# EAGLE design module (EAGLE 9.4.0)
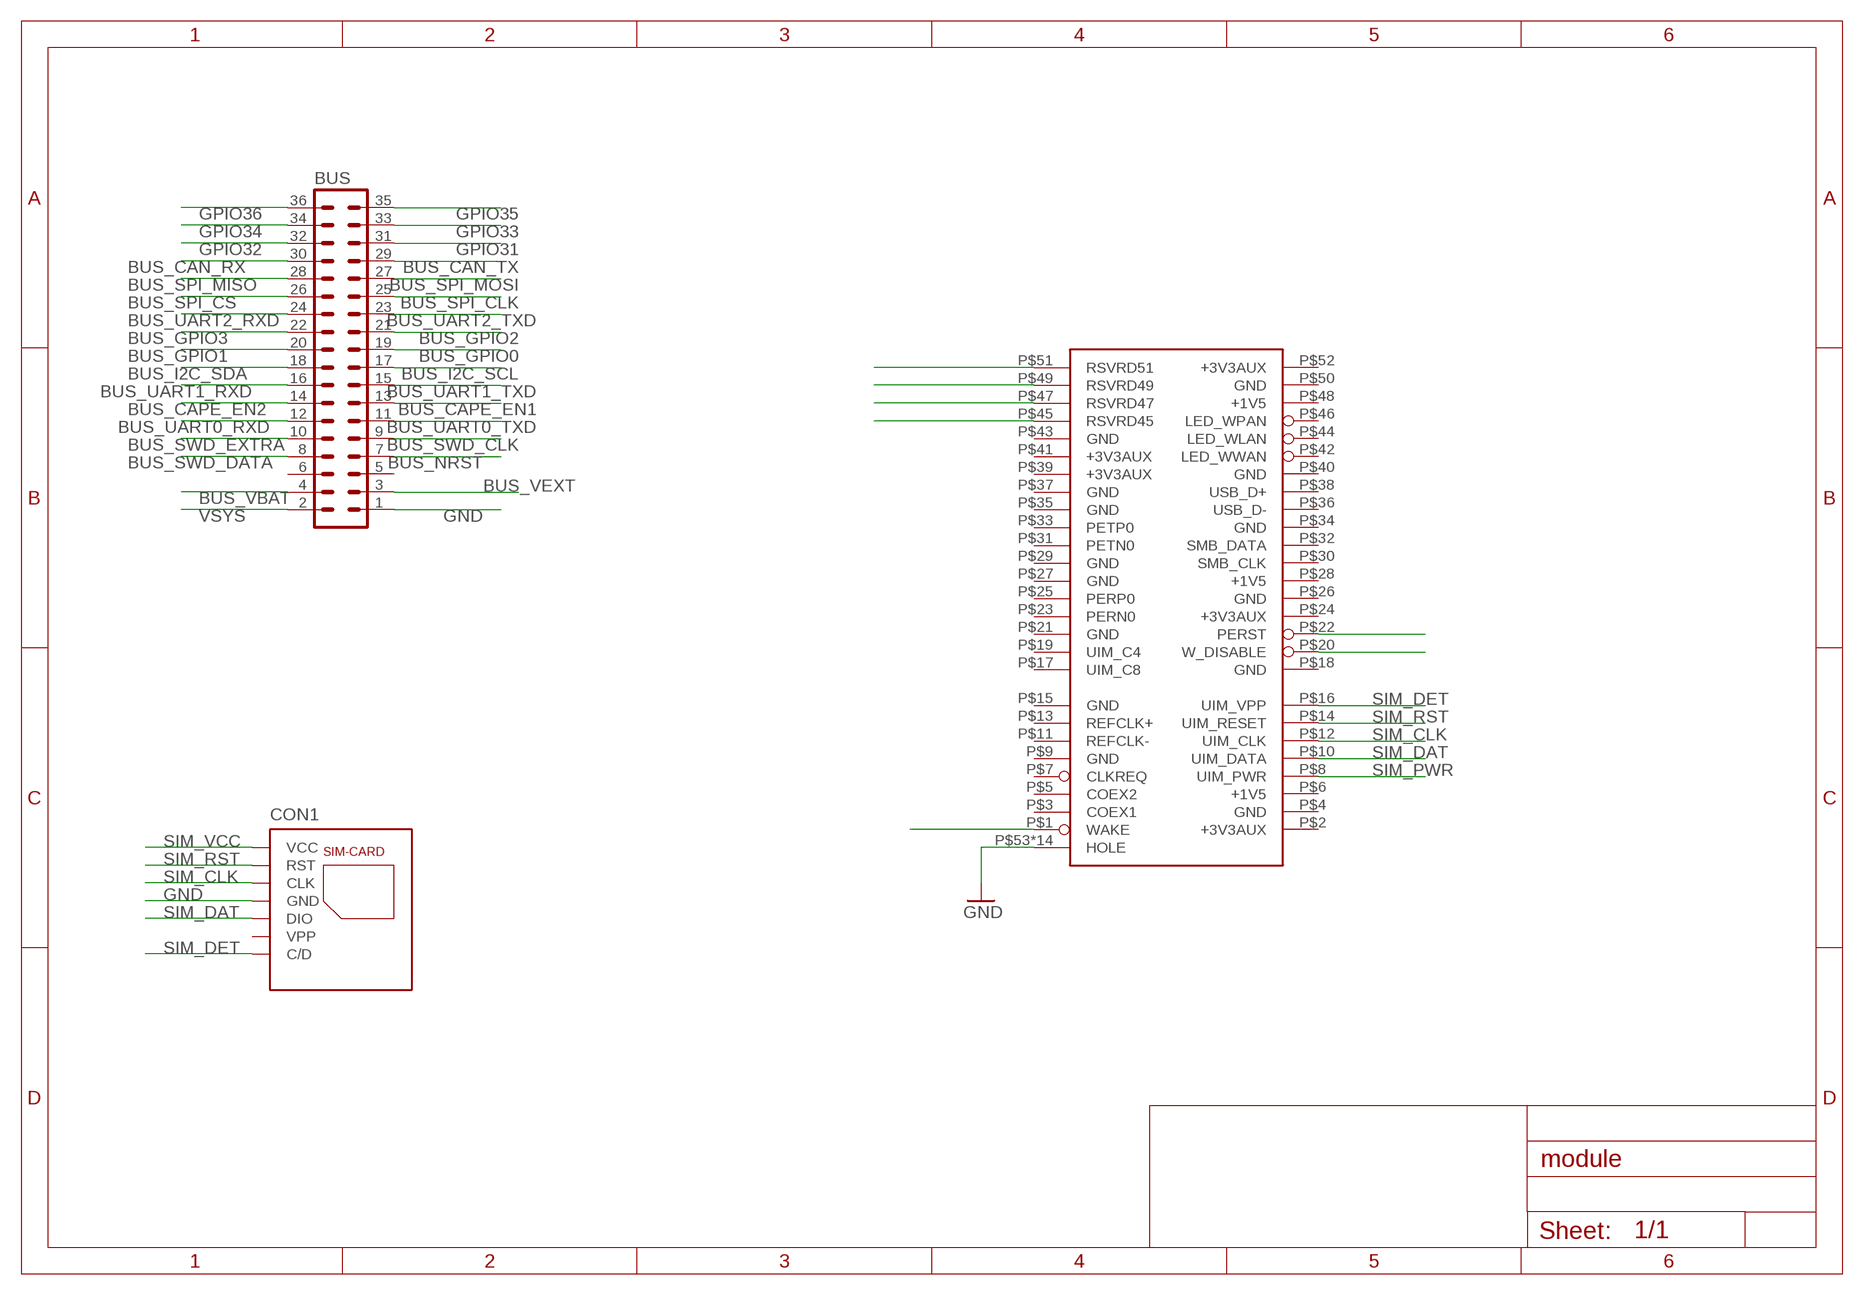
[diagram p0: schematic, sheet 1]

## Parts
BUS  MA18-2  [MA18-2]
CON1  115Q-BCA0  [115Q]
PCI1  119A-XXA00  [119A]

## Nets
BUS_CAN_RX: BUS.30
BUS_CAN_TX: BUS.29
BUS_CAPE_EN1: BUS.13
BUS_CAPE_EN2: BUS.14
BUS_GPIO0: BUS.19
BUS_GPIO1: BUS.20
BUS_GPIO2: BUS.21
BUS_GPIO3: BUS.22
BUS_I2C_SCL: BUS.17
BUS_I2C_SDA: BUS.18
BUS_NRST: BUS.7
BUS_SPI_CLK: BUS.25
BUS_SPI_CS: BUS.26
BUS_SPI_MISO: BUS.28
BUS_SPI_MOSI: BUS.27
BUS_SWD_CLK: BUS.9
BUS_SWD_DATA: BUS.8
BUS_SWD_EXTRA: BUS.10
BUS_UART0_RXD: BUS.12
BUS_UART0_TXD: BUS.11
BUS_UART1_RXD: BUS.16
BUS_UART1_TXD: BUS.15
BUS_UART2_RXD: BUS.24
BUS_UART2_TXD: BUS.23
BUS_VBAT: BUS.4
BUS_VEXT: BUS.3
GND: BUS.1 CON1.GND1(GND) CON1.GND2(GND) CON1.GND3(GND) CON1.GND4(GND) CON1.P5(GND) PCI1.P$53(HOLE) PCI1.P$54(HOLE) PCI1.P$55(HOLE) PCI1.P$56(HOLE) PCI1.P$57(HOLE) PCI1.P$58(HOLE) PCI1.P$59(HOLE) PCI1.P$60(HOLE) PCI1.P$61(HOLE) PCI1.P$62(HOLE) PCI1.P$63(HOLE) PCI1.P$64(HOLE) PCI1.P$65(HOLE) PCI1.P$66(HOLE)
GPIO31: BUS.31
GPIO32: BUS.32
GPIO33: BUS.33
GPIO34: BUS.34
GPIO35: BUS.35
GPIO36: BUS.36
N$1: PCI1.P$51(RSVRD51)
N$2: PCI1.P$49(RSVRD49)
N$3: PCI1.P$47(RSVRD47)
N$4: PCI1.P$45(RSVRD45)
N$5: PCI1.P$20(W_DISABLE)
N$6: PCI1.P$1(WAKE)
N$7: PCI1.P$22(PERST)
SIM_CLK: CON1.P3(CLK) PCI1.P$12(UIM_CLK)
SIM_DAT: CON1.P7(DIO) PCI1.P$10(UIM_DATA)
SIM_DET: CON1.CD(C/D) PCI1.P$16(UIM_VPP)
SIM_PWR: PCI1.P$8(UIM_PWR)
SIM_RST: CON1.P2(RST) PCI1.P$14(UIM_RESET)
SIM_VCC: CON1.P1(VCC)
VSYS: BUS.2
Unconnected: BUS.5 BUS.6 CON1.P6(VPP) PCI1.P$3(COEX1) PCI1.P$5(COEX2) PCI1.P$7(CLKREQ) PCI1.P$11(REFCLK-) PCI1.P$13(REFCLK+) PCI1.P$17(UIM_C8) PCI1.P$19(UIM_C4) PCI1.P$23(PERN0) PCI1.P$25(PERP0) PCI1.P$30(SMB_CLK) PCI1.P$31(PETN0) PCI1.P$33(PETP0) PCI1.P$34(GND) PCI1.P$36(USB_D-) PCI1.P$37(GND) PCI1.P$39(+3V3AUX) PCI1.P$40(GND) PCI1.P$41(+3V3AUX) PCI1.P$42(LED_WWAN) PCI1.P$43(GND) PCI1.P$44(LED_WLAN) PCI1.P$46(LED_WPAN) PCI1.P$48(+1V5) PCI1.P$50(GND)

## Power pins joined to a net without a drawn wire
+1V5: PCI1.P$6(+1V5) PCI1.P$28(+1V5)
+3V3AUX: PCI1.P$2(+3V3AUX) PCI1.P$24(+3V3AUX) PCI1.P$52(+3V3AUX)
GND: PCI1.P$4(GND) PCI1.P$9(GND) PCI1.P$15(GND) PCI1.P$18(GND) PCI1.P$21(GND) PCI1.P$26(GND) PCI1.P$27(GND) PCI1.P$29(GND) PCI1.P$35(GND)
SMB_DATA: PCI1.P$32(SMB_DATA)
USB_D+: PCI1.P$38(USB_D+)

## Library data of the parts
BUS = con-lstb:MA18-2: PIN HEADER; OC_FARNELL: unknown; OC_NEWARK: unknown
CON1 = parts-attend:115Q-BCA0
PCI1 = parts-attend:119A-XXA00

## Board
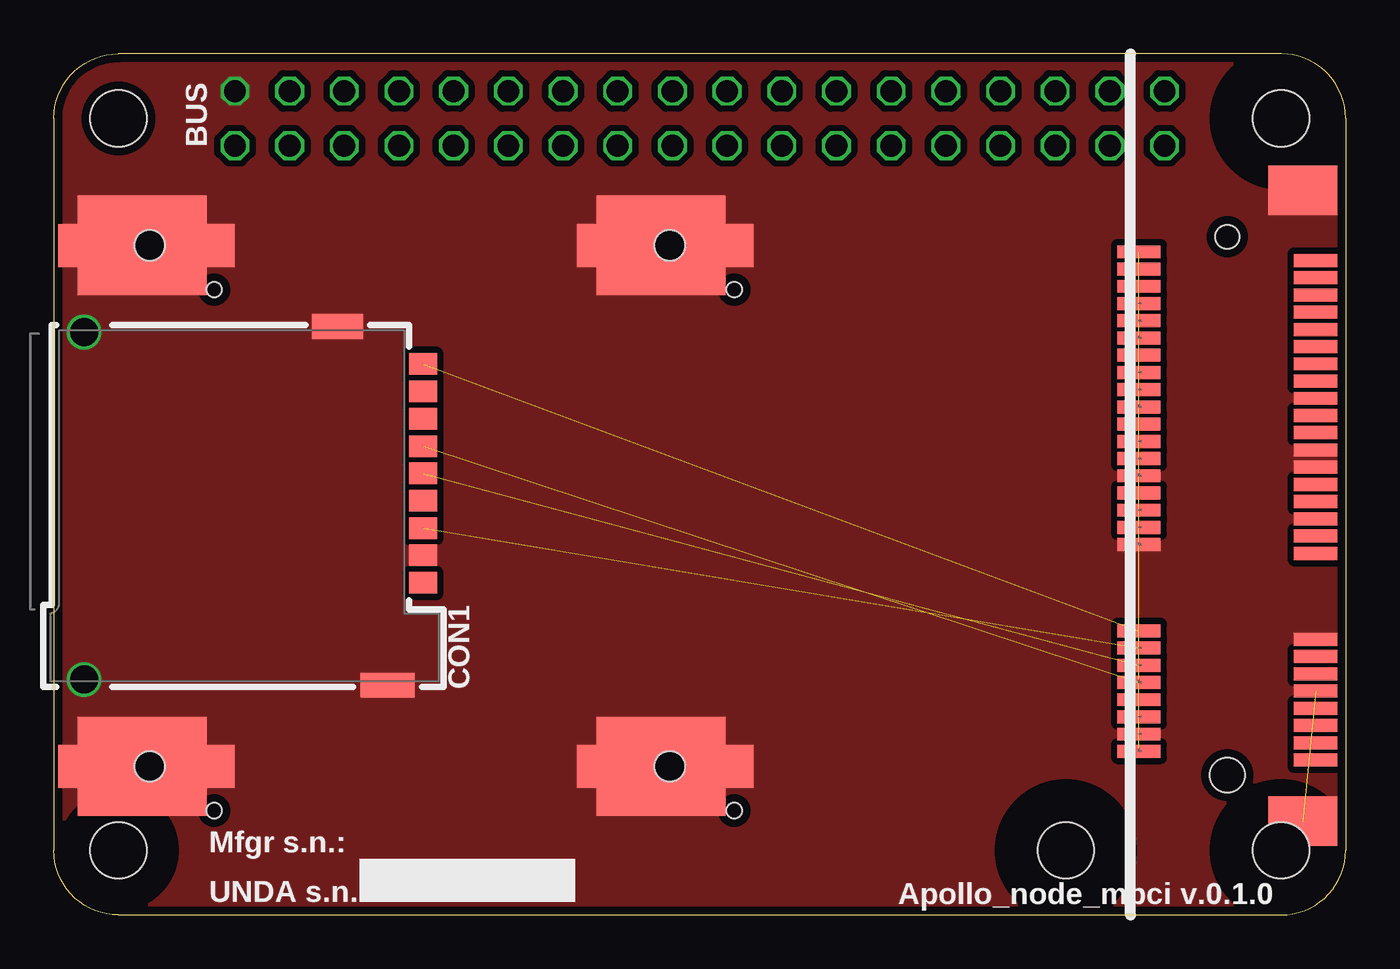
[diagram p1: board, top side]
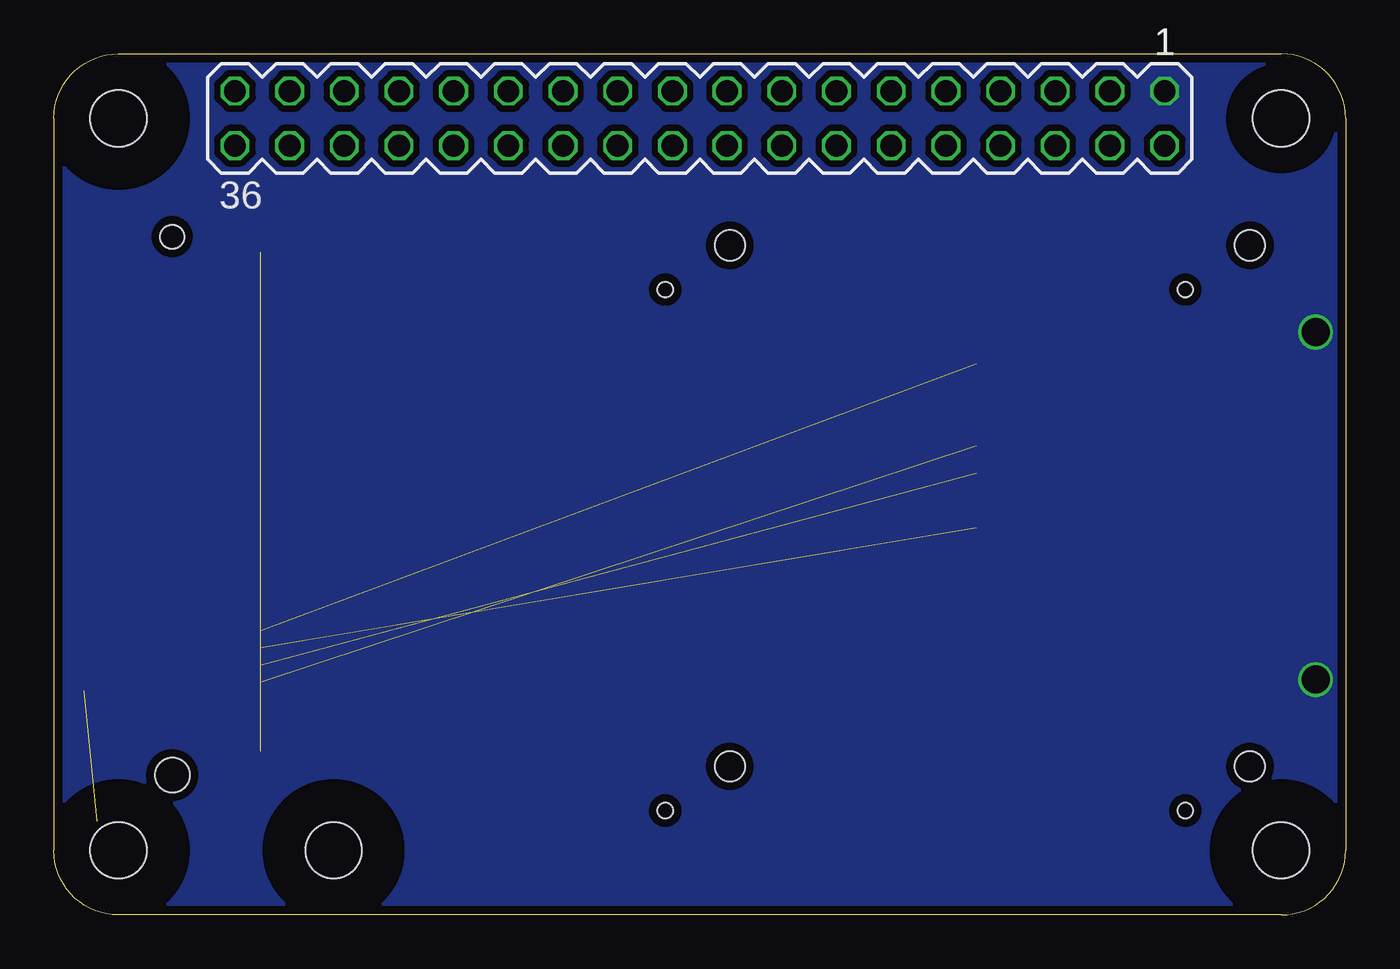
[diagram p2: board, bottom side, seen from below]

Size 60 x 40 mm. Coordinates in mm from the lower left corner, seen from the top.
Outline: 3,0 57,0 arc90 60,3 60,37 arc90 57,40 3,40 arc90 0,37 0,3 arc90 3,0
Copper layers (1*16): Top 0.035mm / dielectric 1mm / Bottom 0.035mm
Design rules "default *": minimum track width 0.2mm, minimum drill 0.3mm, track to track 0.16mm, track to pad 0.16mm, pad to pad 0.16mm, via to via 0.16mm, smd to smd 6mil, copper to edge 0.4mm, drill to drill 0.2mm, minimum pad ring 0.16mm, minimum via ring 0.2mm, stop-mask expansion 0.1mm, vias tented up to drill 0.6mm, thermal gap 10mil
Holes 2.6 mm at 57,3 3,37 3,3 57,37 47,3
tRestrict: area 54,0 to 60,6; area 0.5,0.5 to 5.5,5.5; area 54,34 to 60,40; area 44,0 to 50,6
bRestrict: area 54,0 to 60,6; area 0.8,34.8 to 5.2,39.2; area 0,0 to 6,6; area 54,34 to 60,40; area 44,0 to 50,6

### Footprints (pad centres in the part's own frame; a part is rotated, then mirrored left to right if it is on the bottom)
MA18-2 = drill 1.016 octagon: 1 -21.59,-1.27; 2 -21.59,1.27; 3 -19.05,-1.27; 4 -19.05,1.27; 5 -16.51,-1.27; 6 -16.51,1.27; 7 -13.97,-1.27; 8 -13.97,1.27; 9 -11.43,-1.27; 10 -11.43,1.27; 11 -8.89,-1.27; 12 -8.89,1.27; 13 -6.35,-1.27; 14 -6.35,1.27; 15 -3.81,-1.27; 16 -3.81,1.27; 17 -1.27,-1.27; 18 -1.27,1.27; 19 1.27,-1.27; 20 1.27,1.27; 21 3.81,-1.27; 22 3.81,1.27; 23 6.35,-1.27; 24 6.35,1.27; 25 8.89,-1.27; 26 8.89,1.27; 27 11.43,-1.27; 28 11.43,1.27; 29 13.97,-1.27; 30 13.97,1.27; 31 16.51,-1.27; 32 16.51,1.27; 33 19.05,-1.27; 34 19.05,1.27; 35 21.59,-1.27; 36 21.59,1.27
115Q = smd 1 x 1.3: CD -6.59,0.65; P1 3.57,0.65; P2 1.03,0.65; P3 -1.51,0.65; P4 -4.05,0.65; P5 2.3,0.65; P6 -0.24,0.65; P7 -2.78,0.65; P8 -5.32,0.65 | smd 1.15 x 2.35: GND1 -8.325,-3.32 | smd 1.15 x 2.5: GND2 8.325,-1 | drill 1.3: GND3 -8.07,-15.1; GND4 8.07,-15.1
119A = smd 2 x 0.6: P$1 -4.1,-0.7; P$2 4.1,-1.1; P$3 -4.1,-1.5; P$4 4.1,-1.9; P$5 -4.1,-2.3; P$6 4.1,-2.7; P$7 -4.1,-3.1; P$8 4.1,-3.5; P$9 -4.1,-3.9; P$10 4.1,-4.3; P$11 -4.1,-4.7; P$12 4.1,-5.1; P$13 -4.1,-5.5; P$14 4.1,-5.9; P$15 -4.1,-6.3; P$16 4.1,-6.7; P$17 -4.1,-10.3; P$18 4.1,-10.7; P$19 -4.1,-11.1; P$20 4.1,-11.5; P$21 -4.1,-11.9; P$22 4.1,-12.3; P$23 -4.1,-12.7; P$24 4.1,-13.1; P$25 -4.1,-13.5; P$26 4.1,-13.9; P$27 -4.1,-14.3; P$28 4.1,-14.7; P$29 -4.1,-15.1; P$30 4.1,-15.5; P$31 -4.1,-15.9; P$32 4.1,-16.3; P$33 -4.1,-16.7; P$34 4.1,-17.1; P$35 -4.1,-17.5; P$36 4.1,-17.9; P$37 -4.1,-18.3; P$38 4.1,-18.7; P$39 -4.1,-19.1; P$40 4.1,-19.5; P$41 -4.1,-19.9; P$42 4.1,-20.3; P$43 -4.1,-20.7; P$44 4.1,-21.1; P$45 -4.1,-21.5; P$46 4.1,-21.9; P$47 -4.1,-22.3; P$48 4.1,-22.7; P$49 -4.1,-23.1; P$50 4.1,-23.5; P$51 -4.1,-23.9; P$52 4.1,-24.3 | smd 3.2 x 2.3: P$53 -3.5,2.15; P$54 -3.5,-27.15 | smd 6 x 4.6: P$55 50.4,-0.4; P$58 26.3,-0.4; P$61 50.4,-24.6; P$64 26.3,-24.6 | smd 1.3 x 2: P$56 46.75,-0.4; P$59 22.65,-0.4; P$62 46.75,-24.6; P$65 22.65,-24.6 | smd 0.9 x 2: P$57 53.85,-0.4; P$60 29.75,-0.4; P$63 53.85,-24.6; P$66 29.75,-24.6 | hole 1.6: 0,0 | hole 1.1: 0,-25 | hole 1.4: 25.9,-0.4; 25.9,-24.6; 50.05,-0.4; 50.05,-24.6 | hole 0.7: 47.05,1.65; 22.9,1.65; 47.05,-22.55; 22.9,-22.55

### Placement (x,y rotation side)
BUS  30,37 180 bottom
CON1  16.5,19 270 top
PCI1  54.5,6.5 180 top

### Tracks (layer width: path | path; a pad name or v marks a point on that pad's centre or on a via)
+1V5  (1 unrouted)
+3V3AUX  (2 unrouted)
GND  (1 unrouted)
  pour Bottom (isolate 0.3, rank 6, no thermals): -2,-2 -2,42 62,42 62,-2
  pour Top (isolate 0.3, no thermals): -4,-4 -4,44 64,44 64,-4
SIM_CLK  (1 unrouted)
SIM_DAT  (1 unrouted)
SIM_DET  (1 unrouted)
SIM_RST  (1 unrouted)

### Text on the board
tPlace: Mfgr s.n.: | UNDA s.n.: | Apollo_node_mpci v.0.1.0